# Altium schematic sheet connector.SchDoc
size A
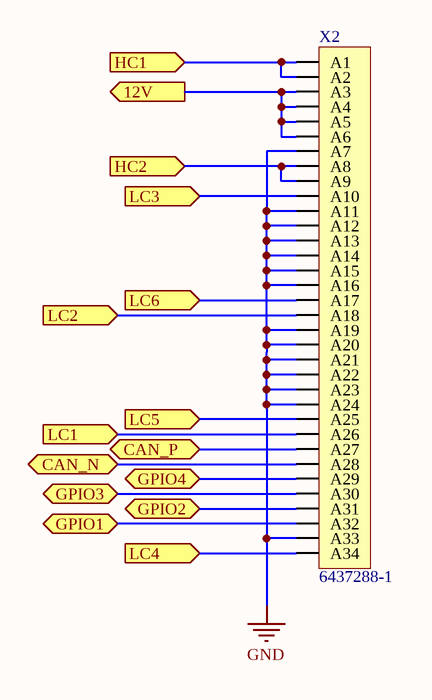
[diagram p0: connector.SchDoc]

## Parts
X2  6437288-1  [6437288-1]

## Ports
12V (out), CAN_N (bidir), CAN_P (bidir), GPIO1 (bidir), GPIO2 (bidir), GPIO3 (bidir), GPIO4 (bidir), HC1 (in), HC2 (in), LC1 (in), LC2 (in), LC3 (in), LC4 (in), LC5 (in), LC6 (in)

## Nets
GND: X2.A7 X2.A11 X2.A12 X2.A13 X2.A14 X2.A15 X2.A16 X2.A19 X2.A20 X2.A21 X2.A22 X2.A23 X2.A24 X2.A33
12V: X2.A3 X2.A4 X2.A5 X2.A6 ; port 12V
CAN_N: X2.A28 ; port CAN_N
CAN_P: X2.A27 ; port CAN_P
GPIO1: X2.A32 ; port GPIO1
GPIO2: X2.A31 ; port GPIO2
GPIO3: X2.A30 ; port GPIO3
GPIO4: X2.A29 ; port GPIO4
HC1: X2.A1 X2.A2 ; port HC1
HC2: X2.A8 X2.A9 ; port HC2
LC1: X2.A26 ; port LC1
LC2: X2.A18 ; port LC2
LC3: X2.A10 ; port LC3
LC4: X2.A34 ; port LC4
LC5: X2.A25 ; port LC5
LC6: X2.A17 ; port LC6

## Library data of the parts
X2 = 6437288-1: Superseal 34P; Circuits: 34; Name: 6437288-1; ComponentLink1Description: Digikey; ComponentLink1URL: https://www.digikey.com/products/en?mpart=6437288-1&&csp=WT.z_cid%3Dsp_8004_20120425_buynow%26TE_cid%3D8004-1541898693362